# EAGLE schematic Mixer-Analog-LM3900 (EAGLE 8.3.2)
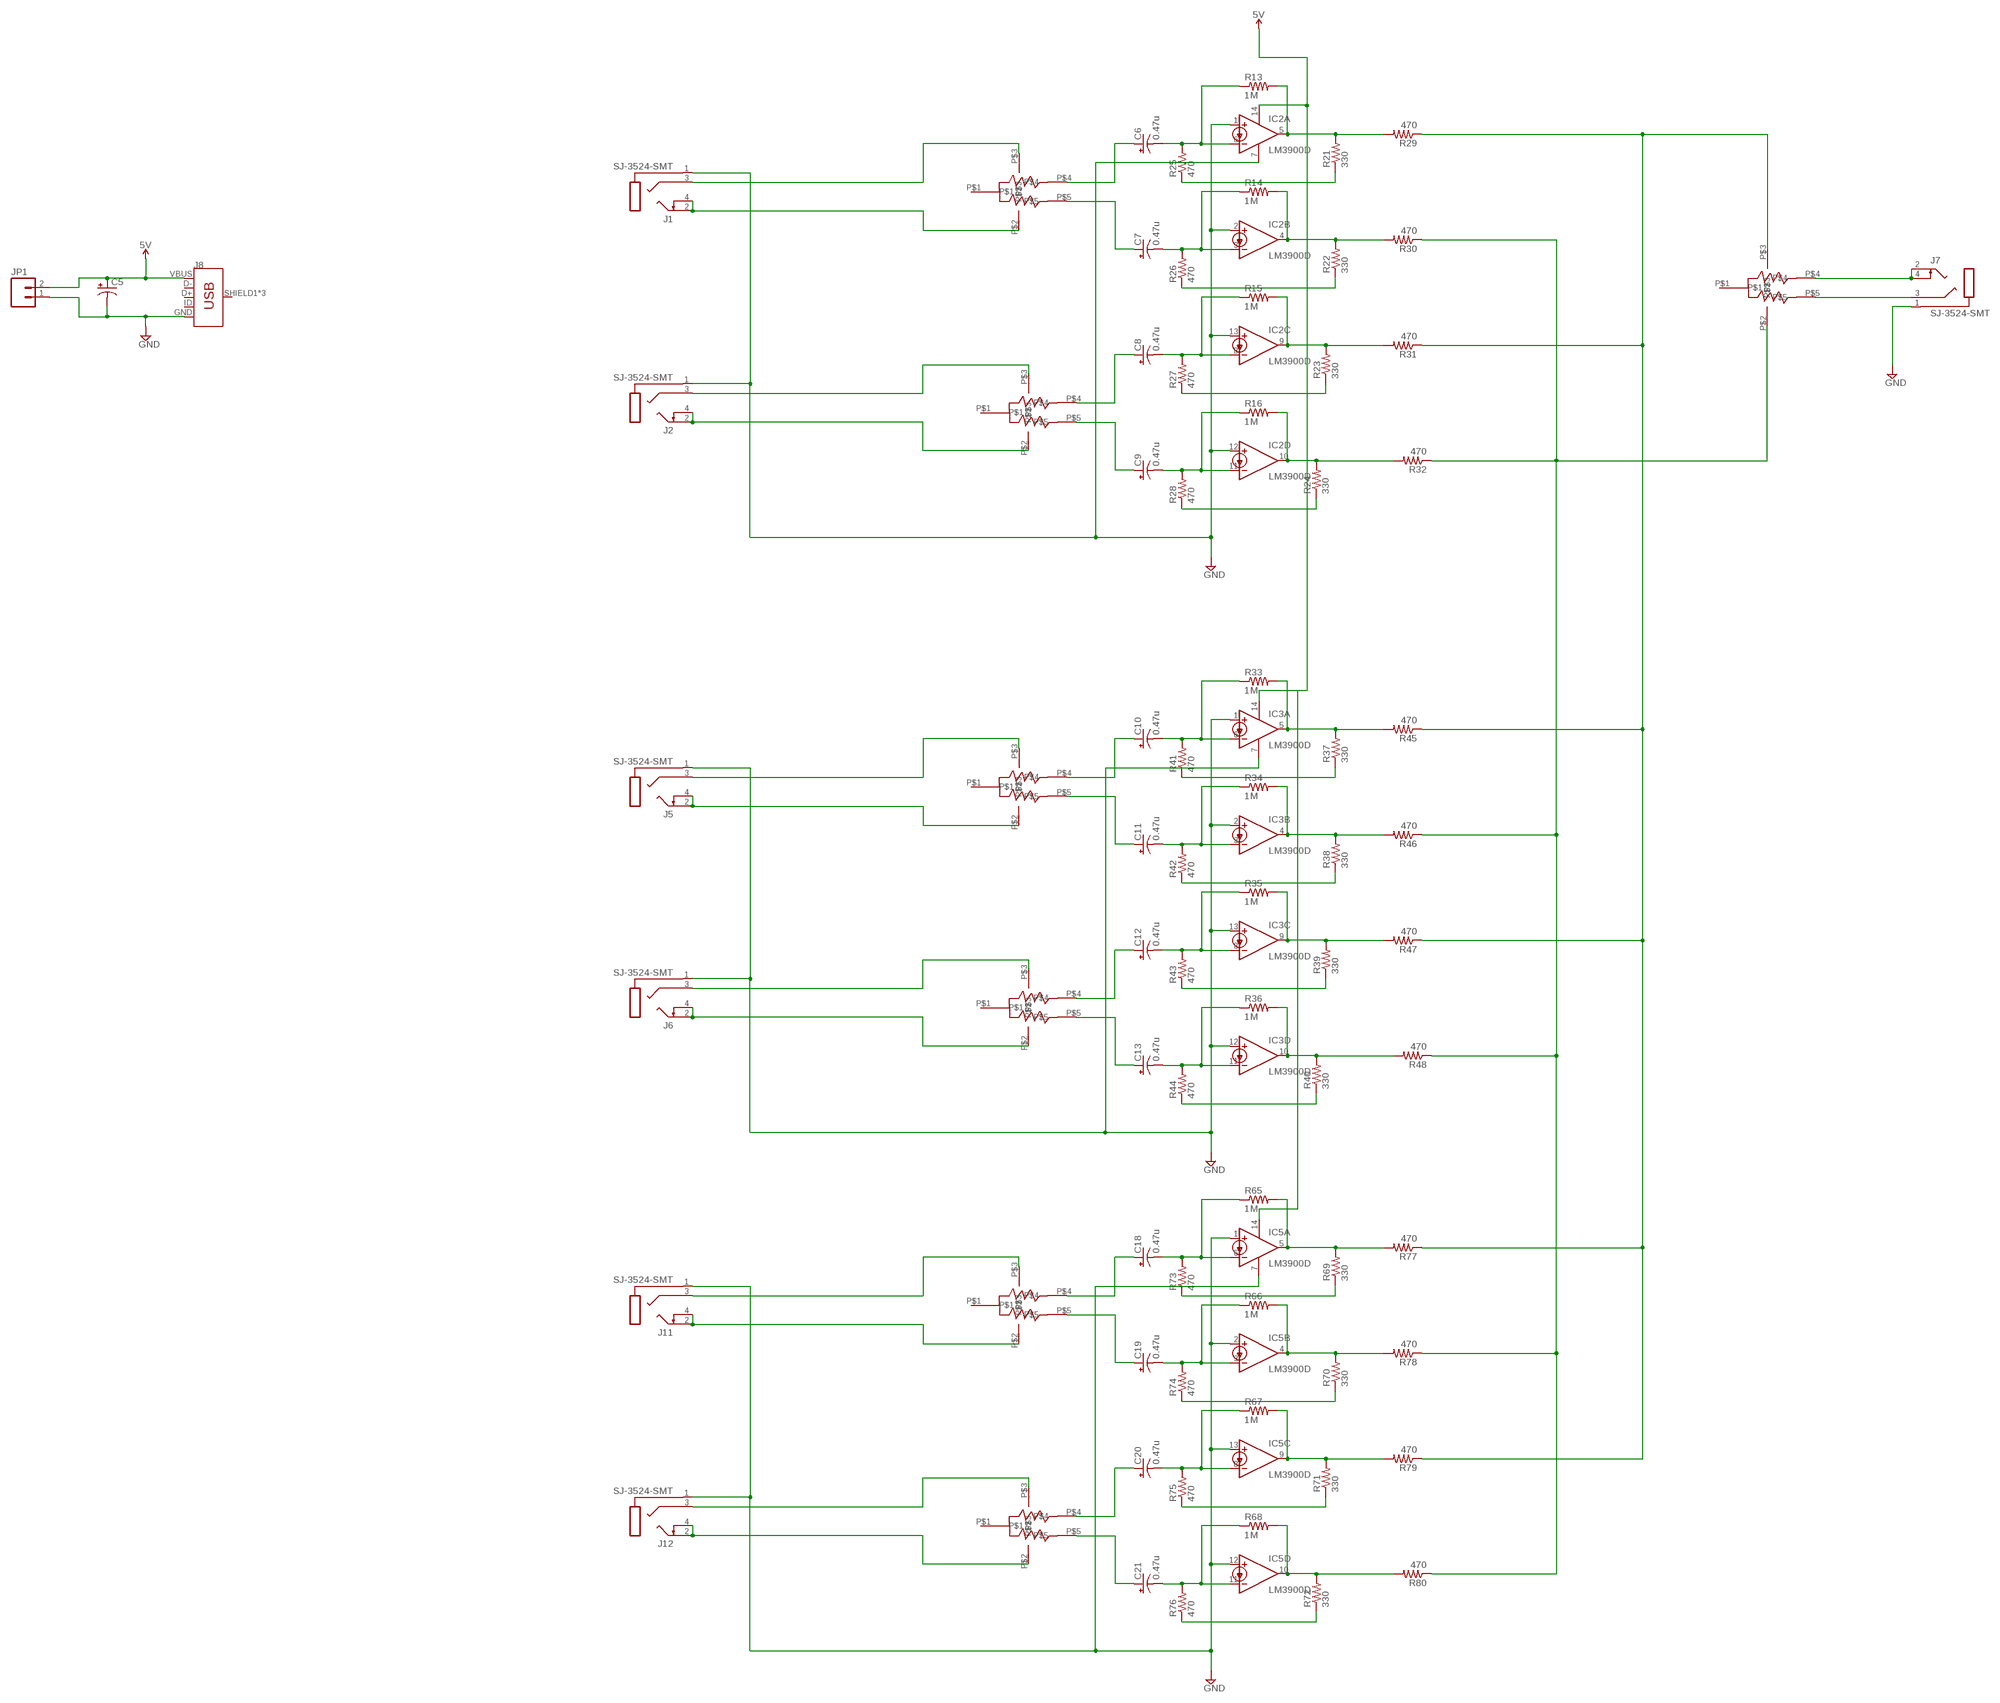
[diagram p0: schematic, sheet 1]

## Parts
C5  CAP_POLPTH1  [CPOL-RADIAL-100UF-25V]
C6  0.47u  CAP_POL1206-KIT  [EIA3216-KIT]
C7  0.47u  CAP_POL1206-KIT  [EIA3216-KIT]
C8  0.47u  CAP_POL1206-KIT  [EIA3216-KIT]
C9  0.47u  CAP_POL1206-KIT  [EIA3216-KIT]
C10  0.47u  CAP_POL1206-KIT  [EIA3216-KIT]
C11  0.47u  CAP_POL1206-KIT  [EIA3216-KIT]
C12  0.47u  CAP_POL1206-KIT  [EIA3216-KIT]
C13  0.47u  CAP_POL1206-KIT  [EIA3216-KIT]
C18  0.47u  CAP_POL1206-KIT  [EIA3216-KIT]
C19  0.47u  CAP_POL1206-KIT  [EIA3216-KIT]
C20  0.47u  CAP_POL1206-KIT  [EIA3216-KIT]
C21  0.47u  CAP_POL1206-KIT  [EIA3216-KIT]
IC2  LM3900D  [SO14]
IC3  LM3900D  [SO14]
IC5  LM3900D  [SO14]
J1  SJ-3524-SMT  [SJ-3524-SMT]
J2  SJ-3524-SMT  [SJ-3524-SMT]
J5  SJ-3524-SMT  [SJ-3524-SMT]
J6  SJ-3524-SMT  [SJ-3524-SMT]
J7  SJ-3524-SMT  [SJ-3524-SMT]
J8  USB_MICRO-B_FEMALE-SMT  [USB-B-MICRO-SMD]
J11  SJ-3524-SMT  [SJ-3524-SMT]
J12  SJ-3524-SMT  [SJ-3524-SMT]
JP1  M02LOCK  [1X02_LOCK]
R13  1M  RESISTOR1206  [1206]
R14  1M  RESISTOR1206  [1206]
R15  1M  RESISTOR1206  [1206]
R16  1M  RESISTOR1206  [1206]
R21  330  RESISTOR1206  [1206]
R22  330  RESISTOR1206  [1206]
R23  330  RESISTOR1206  [1206]
R24  330  RESISTOR1206  [1206]
R25  470  RESISTOR1206  [1206]
R26  470  RESISTOR1206  [1206]
R27  470  RESISTOR1206  [1206]
R28  470  RESISTOR1206  [1206]
R29  470  RESISTOR1206  [1206]
R30  470  RESISTOR1206  [1206]
R31  470  RESISTOR1206  [1206]
R32  470  RESISTOR1206  [1206]
R33  1M  RESISTOR1206  [1206]
R34  1M  RESISTOR1206  [1206]
R35  1M  RESISTOR1206  [1206]
R36  1M  RESISTOR1206  [1206]
R37  330  RESISTOR1206  [1206]
R38  330  RESISTOR1206  [1206]
R39  330  RESISTOR1206  [1206]
R40  330  RESISTOR1206  [1206]
R41  470  RESISTOR1206  [1206]
R42  470  RESISTOR1206  [1206]
R43  470  RESISTOR1206  [1206]
R44  470  RESISTOR1206  [1206]
R45  470  RESISTOR1206  [1206]
R46  470  RESISTOR1206  [1206]
R47  470  RESISTOR1206  [1206]
R48  470  RESISTOR1206  [1206]
R65  1M  RESISTOR1206  [1206]
R66  1M  RESISTOR1206  [1206]
R67  1M  RESISTOR1206  [1206]
R68  1M  RESISTOR1206  [1206]
R69  330  RESISTOR1206  [1206]
R70  330  RESISTOR1206  [1206]
R71  330  RESISTOR1206  [1206]
R72  330  RESISTOR1206  [1206]
R73  470  RESISTOR1206  [1206]
R74  470  RESISTOR1206  [1206]
R75  470  RESISTOR1206  [1206]
R76  470  RESISTOR1206  [1206]
R77  470  RESISTOR1206  [1206]
R78  470  RESISTOR1206  [1206]
R79  470  RESISTOR1206  [1206]
R80  470  RESISTOR1206  [1206]
U$3  POT-DUAL-ALPS-RK10J12E0A0A  [POT-DUAL-ALPS-RK10J12E0A0A]
U$4  POT-DUAL-ALPS-RK10J12E0A0A  [POT-DUAL-ALPS-RK10J12E0A0A]
U$5  POT-DUAL-ALPS-RK10J12E0A0A  [POT-DUAL-ALPS-RK10J12E0A0A]
U$6  POT-DUAL-ALPS-RK10J12E0A0A  [POT-DUAL-ALPS-RK10J12E0A0A]
U$7  POT-DUAL-ALPS-RK10J12E0A0A  [POT-DUAL-ALPS-RK10J12E0A0A]
U$10  POT-DUAL-ALPS-RK10J12E0A0A  [POT-DUAL-ALPS-RK10J12E0A0A]
U$11  POT-DUAL-ALPS-RK10J12E0A0A  [POT-DUAL-ALPS-RK10J12E0A0A]

## Nets
5V: C5.1(+) IC2.14(P:V+) IC3.14(P:V+) IC5.14(P:V+) J8.VBUS JP1.2
GND: C5.2(-) IC2.1(A:+IN) IC2.2(B:+IN) IC2.7(P:GND) IC2.12(D:+IN) IC2.13(C:+IN) IC3.1(A:+IN) IC3.2(B:+IN) IC3.7(P:GND) IC3.12(D:+IN) IC3.13(C:+IN) IC5.1(A:+IN) IC5.2(B:+IN) IC5.7(P:GND) IC5.12(D:+IN) IC5.13(C:+IN) J1.1(S) J2.1(S) J5.1(S) J6.1(S) J7.1(S) J8.GND J11.1(S) J12.1(S) JP1.1
N$18: IC2.5(A:OUT) R13.2 R21.2 R29.2
N$21: C6.C(-) IC2.6(A:-IN) R13.1 R25.2
N$23: R21.1 R25.1
N$24: IC2.4(B:OUT) R14.2 R22.2 R30.2
N$25: C7.C(-) IC2.3(B:-IN) R14.1 R26.2
N$26: R22.1 R26.1
N$27: IC2.9(C:OUT) R15.2 R23.2 R31.2
N$28: C8.C(-) IC2.8(C:-IN) R15.1 R27.2
N$29: R23.1 R27.1
N$30: IC2.10(D:OUT) R16.2 R24.2 R32.2
N$31: C9.C(-) IC2.11(D:-IN) R16.1 R28.2
N$32: R24.1 R28.1
N$33: C9.A(+) U$3.P$5
N$34: C8.A(+) U$3.P$4
N$35: C7.A(+) U$4.P$5
N$36: C6.A(+) U$4.P$4
N$37: J1.2(T) J1.4(TS) U$4.P$2
N$38: J2.2(T) J2.4(TS) U$3.P$2
N$39: J2.3(R) U$3.P$3
N$40: J1.3(R) U$4.P$3
N$43: IC3.5(A:OUT) R33.2 R37.2 R45.2
N$44: C10.C(-) IC3.6(A:-IN) R33.1 R41.2
N$45: R37.1 R41.1
N$46: IC3.4(B:OUT) R34.2 R38.2 R46.2
N$47: C11.C(-) IC3.3(B:-IN) R34.1 R42.2
N$48: R38.1 R42.1
N$49: IC3.9(C:OUT) R35.2 R39.2 R47.2
N$50: C12.C(-) IC3.8(C:-IN) R35.1 R43.2
N$51: R39.1 R43.1
N$52: IC3.10(D:OUT) R36.2 R40.2 R48.2
N$53: C13.C(-) IC3.11(D:-IN) R36.1 R44.2
N$54: R40.1 R44.1
N$55: C13.A(+) U$5.P$5
N$56: C12.A(+) U$5.P$4
N$57: C11.A(+) U$6.P$5
N$58: C10.A(+) U$6.P$4
N$59: J5.2(T) J5.4(TS) U$6.P$2
N$60: J6.2(T) J6.4(TS) U$5.P$2
N$61: J7.2(T) J7.4(TS) U$7.P$4
N$62: J7.3(R) U$7.P$5
N$64: J6.3(R) U$5.P$3
N$66: J5.3(R) U$6.P$3
N$91: IC5.5(A:OUT) R65.2 R69.2 R77.2
N$92: C18.C(-) IC5.6(A:-IN) R65.1 R73.2
N$93: R69.1 R73.1
N$94: IC5.4(B:OUT) R66.2 R70.2 R78.2
N$95: C19.C(-) IC5.3(B:-IN) R66.1 R74.2
N$96: R70.1 R74.1
N$97: IC5.9(C:OUT) R67.2 R71.2 R79.2
N$98: C20.C(-) IC5.8(C:-IN) R67.1 R75.2
N$99: R71.1 R75.1
N$100: IC5.10(D:OUT) R68.2 R72.2 R80.2
N$101: C21.C(-) IC5.11(D:-IN) R68.1 R76.2
N$102: R72.1 R76.1
N$103: C21.A(+) U$10.P$5
N$104: C20.A(+) U$10.P$4
N$105: C19.A(+) U$11.P$5
N$106: C18.A(+) U$11.P$4
N$107: J11.2(T) J11.4(TS) U$11.P$2
N$108: J12.2(T) J12.4(TS) U$10.P$2
N$109: J12.3(R) U$10.P$3
N$110: J11.3(R) U$11.P$3
N$111: R29.1 R31.1 R45.1 R47.1 R77.1 R79.1 U$7.P$3
N$112: R30.1 R32.1 R46.1 R48.1 R78.1 R80.1 U$7.P$2
Unconnected: J8.D+ J8.D- J8.ID J8.SHIELD1(SHIELD) J8.SHIELD2(SHIELD) J8.SHIELD3(SHIELD) U$3.P$1 U$4.P$1 U$5.P$1 U$6.P$1 U$7.P$1 U$10.P$1 U$11.P$1

## Library data of the parts
C5-C13 C18-C21 = SparkFun-Passives:CAP_POL: Capacitor Polarized These are standard SMD and PTH capacitors. Normally 10uF, 47uF, and 100uF in electrolytic and tantalum varieties. Always verify the external diameter of the through hole cap, it varies with capacity, voltage, and manufacturer. The EIA devices should be standard.
IC2 IC3 IC5 = linear:LM3900: OP AMP
J1 J2 J5-J7 J11 J12 = con-cuistack:SJ-3524: 3.5 Stereo audio jack (SMT)
J8 = SparkFun-Connectors:USB_MICRO-B: USB Type Micro-B Connector Male/female and PTH/SMT variants SparkFun Products: SparkFun microB USB Breakout <https://www.sparkfun.com/products/12035> SparkFun USB microB Plug Breakout <https://www.sparkfun.com/products/10031> SparkFun ESP8266 Thing <https://www.sparkfun.com/products/13231>; PROD_ID: CONN-11752
JP1 = CMU-ArtFab:M02: Header 2 Standard 2-pin 0.1" header. Use with straight break away headers (SKU : PRT-00116), right angle break away headers (PRT-00553), swiss pins (PRT-00743), machine pins (PRT-00117), and female headers (PRT-00115). Molex polarized connector foot print use with SKU : PRT-08233 with associated crimp pins and housings.
R13-R16 R21-R48 R65-R80 = SparkFun-Passives:RESISTOR: Resistor Basic schematic elements and footprints for 0603, 1206, and PTH resistors.
U$3-U$7 U$10 U$11 = CMU-ArtFab:POT-DUAL-ALPS-RK10J12E0A0A